# Altium schematic sheet shunts.SchDoc: Current Shunts
size A3; DocumentNumber: 1; SheetNumber: 3; SheetTotal: 5
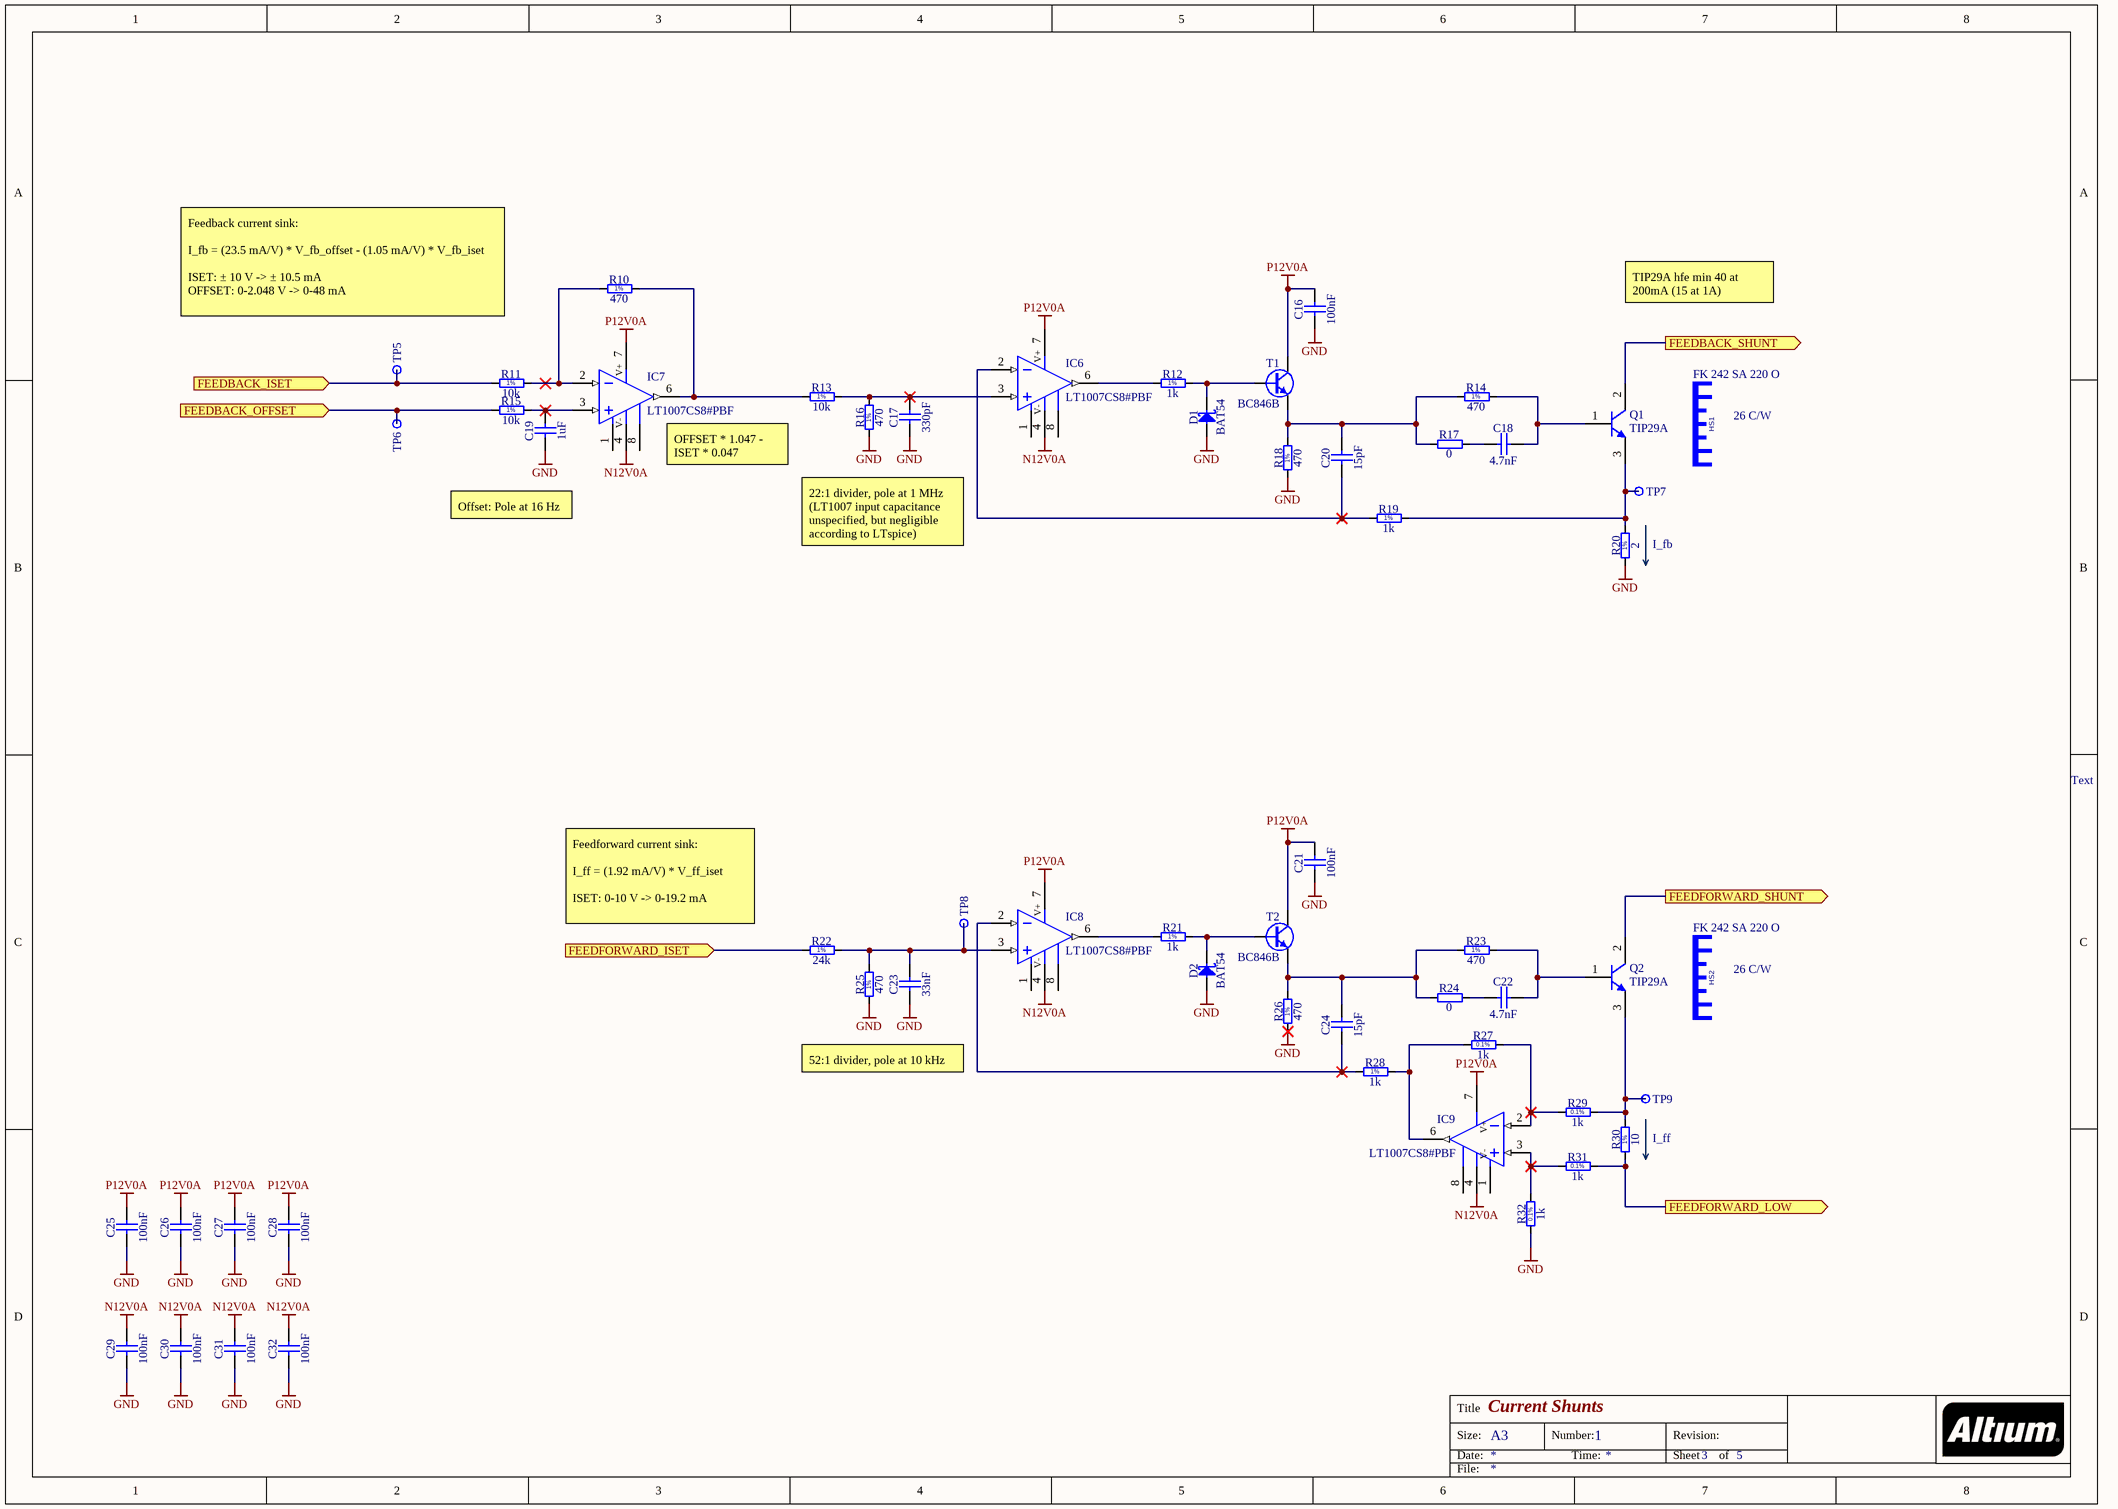
[diagram p0: shunts.SchDoc]

## Parts
C16  100nF  [CAPC1608X87N]
C17  330pF  [CAPC1608X87N]
C18  4.7nF  [CAPC1608X87N]
C19  1uF  [CAPC1608X87N]
C20  15pF  [CAPC1608X87N]
C21  100nF  [CAPC1608X87N]
C22  4.7nF  [CAPC1608X87N]
C23  33nF  [CAPC1608X87N]
C24  15pF  [CAPC1608X87N]
C25  100nF  [CAPC1608X87N]
C26  100nF  [CAPC1608X87N]
C27  100nF  [CAPC1608X87N]
C28  100nF  [CAPC1608X87N]
C29  100nF  [CAPC1608X87N]
C30  100nF  [CAPC1608X87N]
C31  100nF  [CAPC1608X87N]
C32  100nF  [CAPC1608X87N]
D1  BAT54  [SOT95P240X130-3N]
D2  BAT54  [SOT95P240X130-3N]
HS1  Manufacturer Part Number: FK 242 SA 220 O  [HSINK_FISCHER_FK 242 SA 220 O_h]  (hidden comment: Heat Sink No Pad)
HS2  Manufacturer Part Number: FK 242 SA 220 O  [HSINK_FISCHER_FK 242 SA 220 O_h]  (hidden comment: Heat Sink No Pad)
IC6  LT1007CS8#PBF  [SOIC127P600X175-8N]
IC7  LT1007CS8#PBF  [SOIC127P600X175-8N]
IC8  LT1007CS8#PBF  [SOIC127P600X175-8N]
IC9  LT1007CS8#PBF  [SOIC127P600X175-8N]
Q1  TIP29A  [ONSC-TO-220-3-221A-09]
Q2  TIP29A  [ONSC-TO-220-3-221A-09]
R10  470  [RESC1608X55N]
R11  10k  [RESC1608X55N]
R12  1k  [RESC1608X55N]
R13  10k  [RESC1608X55N]
R14  470  [RESC1608X55N]
R15  10k  [RESC1608X55N]
R16  470  [RESC1608X55N]
R17  0  [RESC1608X55N]
R18  470  [RESC1608X55N]
R19  1k  [RESC1608X55N]
R20  2  [RESC1608X55N]
R21  1k  [RESC1608X55N]
R22  24k  [RESC1608X55N]
R23  470  [RESC1608X55N]
R24  0  [RESC1608X55N]
R25  470  [RESC1608X55N]
R26  470  [RESC1608X55N]
R27  1k  [RESC1608X55N]
R28  1k  [RESC1608X55N]
R29  1k  [RESC1608X55N]
R30  10  [RESC1608X55N]
R31  1k  [RESC1608X55N]
R32  1k  [RESC1608X55N]
T1  BC846B  [SOT95P230X110-3N]
T2  BC846B  [SOT95P230X110-3N]
TP5  Test Point  [TPS127]  (value not drawn)
TP6  Test Point  [TPS127]  (value not drawn)
TP7  Test Point  [TPS127]  (value not drawn)
TP8  Test Point  [TPS127]  (value not drawn)
TP9  Test Point  [TPS127]  (value not drawn)

## Ports
FEEDBACK_ISET (in), FEEDBACK_OFFSET (in), FEEDBACK_SHUNT (out), FEEDFORWARD_ISET (in), FEEDFORWARD_LOW (out), FEEDFORWARD_SHUNT (out)

## Nets
GND: C16.1 C17.1 C19.1 C21.1 C23.1 C25.1 C26.1 C27.1 C28.1 C29.1 C30.1 C31.1 C32.1 D1.1(A) D2.1(A) R16.1 R18.1 R20.1 R25.1 R26.1 R32.1
N12V0A: C29.2 C30.2 C31.2 C32.2 IC6.4(V-) IC7.4(V-) IC8.4(V-) IC9.4(V-)
P12V0A: C16.2 C21.2 C25.2 C26.2 C27.2 C28.2 IC6.7(V+) IC7.7(V+) IC8.7(V+) IC9.7(V+) T1.3(C) T2.3(C)
FEEDBACK_ISET: R11.1 TP5.1 ; port FEEDBACK_ISET
FEEDBACK_OFFSET: R15.1 TP6.1 ; port FEEDBACK_OFFSET
FEEDBACK_SHUNT: Q1.2(C) ; port FEEDBACK_SHUNT
FEEDFORWARD_ISET: R22.1 ; port FEEDFORWARD_ISET
FEEDFORWARD_LOW: R30.1 R31.2 ; port FEEDFORWARD_LOW
FEEDFORWARD_SHUNT: Q2.2(C) ; port FEEDFORWARD_SHUNT
NetC17_2: C17.2 IC6.3(IN+) R13.2 R16.2
NetC18_1: C18.1 R17.2
NetC18_2: C18.2 Q1.1(B) R14.2
NetC19_2: C19.2 IC7.3(IN+) R15.2
NetC20_1: C20.1 IC6.2(IN-) R19.1
NetC20_2: C20.2 R14.1 R17.1 R18.2 T1.2(E)
NetC22_1: C22.1 R24.2
NetC22_2: C22.2 Q2.1(B) R23.2
NetC23_2: C23.2 IC8.3(IN+) R22.2 R25.2 TP8.1
NetC24_1: C24.1 IC8.2(IN-) R28.1
NetC24_2: C24.2 R23.1 R24.1 R26.2 T2.2(E)
NetD1_3: D1.3(C) R12.2 T1.1(B)
NetD2_3: D2.3(C) R21.2 T2.1(B)
NetIC6_6: IC6.6(OUT) R12.1
NetIC7_2: IC7.2(IN-) R10.1 R11.2
NetIC7_6: IC7.6(OUT) R10.2 R13.1
NetIC8_6: IC8.6(OUT) R21.1
NetIC9_2: IC9.2(IN-) R27.2 R29.1
NetIC9_3: IC9.3(IN+) R31.1 R32.2
NetIC9_6: IC9.6(OUT) R27.1 R28.2
NetQ1_3: Q1.3(E) R19.2 R20.2 TP7.1
NetQ2_3: Q2.3(E) R29.2 R30.2 TP9.1

Not connected (* = marked no-connect by the designer): IC6 1(OFFSET) 8(OFFSET); IC7 1(OFFSET) 8(OFFSET); IC8 1(OFFSET) 8(OFFSET); IC9 1(OFFSET) 8(OFFSET)

## Notes on the sheet
- Feedback current sink:
  I_fb = (23.5 mA/V) * V_fb_offset - (1.05 mA/V) * V_fb_iset
  ISET: ± 10 V -> ± 10.5 mA
  OFFSET: 0-2.048 V -> 0-48 mA
- TIP29A hfe min 40 at 200mA (15 at 1A)
- (near HS1) 26 C/W
- Offset: Pole at 16 Hz
- (near IC7) OFFSET * 1.047 - ISET * 0.047
- 22:1 divider, pole at 1 MHz (LT1007 input capacitance unspecified, but negligible according to LTspice)
- (near R20) I_fb
- Text
- Feedforward current sink:
  I_ff = (1.92 mA/V) * V_ff_iset
  ISET: 0-10 V -> 0-19.2 mA
- (near HS2) 26 C/W
- 52:1 divider, pole at 10 kHz
- I_ff
- Title
- Size:
- Date:
- A3
- Number:
- Time:
- Revision:
- Sheet
- of
- File:
- (in symbol R0603_1K_0.1%_0.063W_10PPM) 0.1%
- (in symbol R0603_1K_1%_0.1W_100PPM) 1%
- (in symbol R0603_2R_1%_0.1W_200PPM) 1%
- (in symbol R0603_10K_1%_0.1W_100PPM) 1%
- (in symbol R0603_10R_1%_0.1W_200PPM) 1%
- (in symbol R0603_24K_1%_0.1W_100PPM) 1%
- (in symbol R0603_470R_1%_0.1W_100PPM) 1%

## Library data of the parts
C16 C21 C25-C32 = CC0603_100NF_50V_10%_X5R: Non-polarised capacitor; Part Description: SMD Multilayer Chip Ceramic Capacitor; Manufacturer: GENERIC; Manufacturer1 Part Number: C1608X5R1H104K080AA; Voltage: 50V; TC: X5R; Tolerance: ±10%; Part Number: CC0603_100NF_50V_10%_X5R; Component Kind: Standard; Component Type: Standard; Pin Count: 2; Value: 100nF; Status: None; Manufacturer Part Number: CC0603_100NF_50V_10%_X5R; Case: 0603; Mounted: Yes; Socket: No; SMD: Yes; Sense: No; Manufacturer1 Example: TDK; Manufacturer1 ComponentHeight: 0.9mm; HelpURL: \\cern.ch\dfs\Applications\Altium\Datasheets\CC0603_X5R_TDK_C.pdf; Author: CERN DEM MR; CreateDate: 08/01/2016; LatestRevisionDate: 08/01/2016
C17 = CC0603_330PF_50V_5%_NP0: Non-polarised capacitor; Part Description: SMD Multilayer Chip Ceramic Capacitor; Manufacturer: GENERIC; Manufacturer1 Part Number: 223886715331; Voltage: 50V; TC: C0G/NP0; Tolerance: ±5%; Part Number: CC0603_330PF_50V_5%_NP0; Component Kind: Standard; Component Type: Standard; Pin Count: 2; Value: 330pF; Status: Preferred; Manufacturer Part Number: CC0603_330PF_50V_5%_NP0; Case: 0603; Mounted: Yes; Socket: No; SMD: Yes; Sense: No; Manufacturer1 Example: PHYCOMP; Manufacturer1 ComponentHeight: 0.87mm; HelpURL: \\cern.ch\dfs\Applications\Altium\Datasheets\CC0603_NP0_PHYCOMP.pdf; Author: CERN DEM JLC; CreateDate: 03/12/2007; LatestRevisionDate: 03/12/2007
C18 C22 = CC0603_4.7NF_50V_10%_X7R: Non-polarised capacitor; Part Description: SMD Multilayer Chip Ceramic Capacitor; Manufacturer: GENERIC; Manufacturer1 Part Number: 223858615632; Voltage: 50V; TC: X7R; Tolerance: ±10%; Part Number: CC0603_4.7NF_50V_10%_X7R; Component Kind: Standard; Component Type: Standard; Pin Count: 2; Value: 4.7nF; Status: Preferred; Manufacturer Part Number: CC0603_4.7NF_50V_10%_X7R; Case: 0603; Mounted: Yes; Socket: No; SMD: Yes; Sense: No; Manufacturer1 Example: PHYCOMP; Manufacturer1 ComponentHeight: 0.87mm; HelpURL: \\cern.ch\dfs\Applications\Altium\Datasheets\CC0603_X7R_PHYCOMP.pdf; Author: CERN DEM JLC; CreateDate: 03/12/2007; LatestRevisionDate: 03/12/2007
C19 = CC0603_1UF_25V_10%_X7R: Non-polarised capacitor; Part Description: SMD Multilayer Chip Ceramic Capacitor; Manufacturer: GENERIC; Manufacturer1 Part Number: GRM188R71E105KA12D; Voltage: 25V; TC: X7R; Tolerance: ±10%; Part Number: CC0603_1UF_25V_10%_X7R; Component Kind: Standard; Component Type: Standard; Pin Count: 2; Value: 1uF; Status: None; Manufacturer Part Number: CC0603_1UF_25V_10%_X7R; Case: 0603; Mounted: Yes; Socket: No; SMD: Yes; Sense: No; Manufacturer1 Example: MURATA; Manufacturer1 ComponentHeight: 0.9mm; HelpURL: \\cern.ch\dfs\Applications\Altium\Datasheets\CC0603_X7R_MURATA.pdf; Author: CERN DEM JLC; CreateDate: 18/01/2011; LatestRevisionDate: 18/01/2011
C20 C24 = CC0603_15PF_50V_5%_NP0: Non-polarised capacitor; Part Description: SMD Multilayer Chip Ceramic Capacitor; Manufacturer: GENERIC; Manufacturer1 Part Number: 223886715159; Voltage: 50V; TC: C0G/NP0; Tolerance: ±5%; Part Number: CC0603_15PF_50V_5%_NP0; Component Kind: Standard; Component Type: Standard; Pin Count: 2; Value: 15pF; Status: Preferred; Manufacturer Part Number: CC0603_15PF_50V_5%_NP0; Case: 0603; Mounted: Yes; Socket: No; SMD: Yes; Sense: No; Manufacturer1 Example: PHYCOMP; Manufacturer1 ComponentHeight: 0.87mm; HelpURL: \\cern.ch\dfs\Applications\Altium\Datasheets\CC0603_NP0_PHYCOMP.pdf; Author: CERN DEM JLC; CreateDate: 03/12/2007; LatestRevisionDate: 03/12/2007
C23 = CC0603_33NF_25V_10%_X7R: Non-polarised capacitor; Part Description: SMD Multilayer Chip Ceramic Capacitor; Manufacturer: GENERIC; Manufacturer1 Part Number: 223891615643; Voltage: 25V; TC: X7R; Tolerance: ±10%; Part Number: CC0603_33NF_25V_10%_X7R; Component Kind: Standard; Component Type: Standard; Pin Count: 2; Value: 33nF; Status: Preferred; Manufacturer Part Number: CC0603_33NF_25V_10%_X7R; Case: 0603; Mounted: Yes; Socket: No; SMD: Yes; Sense: No; Manufacturer1 Example: PHYCOMP; Manufacturer1 ComponentHeight: 0.87mm; HelpURL: \\cern.ch\dfs\Applications\Altium\Datasheets\CC0603_X7R_PHYCOMP.pdf; Author: CERN DEM JLC; CreateDate: 03/12/2007; LatestRevisionDate: 03/12/2007
D1 D2 = BAT54: Diode Schottky  Anode Pin 1 Cathode Pin 3 (Pas de pin 2); Part Description: Single Small Signal Schottky Diode; Manufacturer: FAIRCHILD SEMICONDUCTOR; Voltage: 30V; Power: 200mA; PressFit: No; Bonding: No; Part Number: BAT54; Component Kind: Standard; Component Type: Standard; Device: BAT54; PackageDescription: SOT23 3-Leads, Pitch 0.95mm - Body 1.3x2.9mm, IPC Medium Density; Manufacturer Part Number: BAT54; Pin Count: 3; Case: SOT23-3; Mounted: Yes; Socket: No; SMD: Yes; Sense: No; ComponentHeight: 1.30mm; HelpURL: \\cern.ch\dfs\Applications\Altium\Datasheets\BAT54.pdf; Author: CERN DEM JLC; CreateDate: 17/09/2009; LatestRevisionDate: 27/05/2010
  D1: Digi-Key: *
HS1 HS2 = HSINK_FISCHER_FK 242 SA 220 O_h: Heat Sink Without Pad; Part Description: TO-220 Heat Sink  Rth: 26°C/W - Horizontal Mount; Manufacturer: FISCHER ELEKTRONIK; PressFit: No; Part Number: HSINK_FISCHER_FK 242 SA 220 O_h; Component Kind: Standard; Component Type: Standard; Pin Count: 0; PackageDescription: TO-220 Heat Sink  Rth: 26°C/W - Horizontal Mount; Mounted: Yes; Socket: No; SMD: No; Sense: No; Status: None; ComponentHeight: 12.7mm; HelpURL: \\cern.ch\dfs\Applications\Altium\Datasheets\HSINK_FISCHER_FK 242 SA 220 O.pdf; Author: CERN DEM JLC; CreateDate: 29/03/2011; LatestRevisionDate: 10/10/2011
IC6-IC9 = LT1007CS8#PBF: Operational Amplifier with Offset 1-8; Part Description: Low Noise, High Speed Precision Operational Amplifier; Manufacturer: LINEAR TECHNOLOGY; PressFit: No; Bonding: No; Part Number: LT1007CS8#PBF; Component Kind: Standard; Component Type: Standard; Device: LT1007CS8#PBF; PackageDescription: SOIC 8, Pitch 1.27mm - Body 4x5mm, IPC Medium Density; Manufacturer Part Number: LT1007CS8#PBF; Pin Count: 7; Case: SOIC8; Mounted: Yes; Socket: No; SMD: Yes; Sense: No; ComponentHeight: 1.75mm; Author: CERN DEM JLC; HelpURL: \\cern.ch\dfs\Applications\Altium\Datasheets\LT1007CS8#PBF.pdf; CreateDate: 09/03/2011; LatestRevisionDate: 09/03/2011
Q1 Q2 = TIP29A: Complementary Silicon Plastic Power Transistor, 3-Pin TO-220, Tube; Manufacturer: On Semiconductor; Note: 0; fT Min (MHz): 3; IC Continuous (A): 1; Polarity: NPN; DatasheetVersion: Rev. 12; PackageVersion: Rev. AG, 09/2011; PackageReference: TO-220-3-221A-09; PackageDescription: 3-Pin Flange Mount, Vertical Straight Lead, Body 9.97 x 4.445 mm, Pitch 2.54 mm; Packing: Tube; RoHS: FALSE; Mounting Technology: Through Hole; PartNumber: TIP29A; ComponentLink1Description: Manufacturer URL; ComponentLink1URL: http://www.onsemi.com/; ComponentLink2Description: Datasheet; ComponentLink2URL: http://www.onsemi.com/pub_link/Collateral/TIP29B-D.PDF; ComponentLink3Description: Package Specification; ComponentLink3URL: http://www.onsemi.com/pub_link/Collateral/221A-09.PDF; Manufacturer Part Number: TIP29A; Device: TIP29A
R10 R14 R16 R18 R23 R25 R26 = R0603_470R_1%_0.1W_100PPM: Resistor - 1%; Part Description: General Purpose Thick Film Chip Resistor; Manufacturer: GENERIC; Manufacturer1 Part Number: NRC06F4700TRF; Power: 0.1W; TC: ±100ppm/°C; PressFit: No; Part Number: R0603_470R_1%_0.1W_100PPM; Component Kind: Standard; Component Type: Standard; Pin Count: 2; Value: 470; Status: Preferred; Tolerance: ±1%; Manufacturer Part Number: R0603_470R_1%_0.1W_100PPM; Case: 0603; Mounted: Yes; Sense: No; Socket: No; SMD: Yes; Manufacturer1 Example: NIC COMPONENT; Manufacturer1 ComponentHeight: 0.55mm; HelpURL: \\cern.ch\dfs\Applications\Altium\Datasheets\R0603_NIC_NRC.pdf; Author: CERN DEM JLC; CreateDate: 03/12/2007; LatestRevisionDate: 13/03/2008
R11 R13 R15 = R0603_10K_1%_0.1W_100PPM: Resistor - 1%; Part Description: General Purpose Thick Film Chip Resistor; Manufacturer: GENERIC; Manufacturer1 Part Number: NRC06F1002TRF; Power: 0.1W; TC: ±100ppm/°C; PressFit: No; Part Number: R0603_10K_1%_0.1W_100PPM; Component Kind: Standard; Component Type: Standard; Pin Count: 2; Value: 10k; Status: Preferred; Tolerance: ±1%; Manufacturer Part Number: R0603_10K_1%_0.1W_100PPM; Case: 0603; Mounted: Yes; Sense: No; Socket: No; SMD: Yes; Manufacturer1 Example: NIC COMPONENT; Manufacturer1 ComponentHeight: 0.55mm; HelpURL: \\cern.ch\dfs\Applications\Altium\Datasheets\R0603_NIC_NRC.pdf; Author: CERN DEM JLC; CreateDate: 03/12/2007; LatestRevisionDate: 13/03/2008
R12 R19 R21 R28 = R0603_1K_1%_0.1W_100PPM: Resistor - 1%; Part Description: General Purpose Thick Film Chip Resistor; Manufacturer: GENERIC; Manufacturer1 Part Number: NRC06F1001TRF; Power: 0.1W; TC: ±100ppm/°C; PressFit: No; Part Number: R0603_1K_1%_0.1W_100PPM; Component Kind: Standard; Component Type: Standard; Pin Count: 2; Value: 1k; Status: Preferred; Tolerance: ±1%; Manufacturer Part Number: R0603_1K_1%_0.1W_100PPM; Case: 0603; Mounted: Yes; Sense: No; Socket: No; SMD: Yes; Manufacturer1 Example: NIC COMPONENT; Manufacturer1 ComponentHeight: 0.55mm; HelpURL: \\cern.ch\dfs\Applications\Altium\Datasheets\R0603_NIC_NRC.pdf; Author: CERN DEM JLC; CreateDate: 03/12/2007; LatestRevisionDate: 13/03/2008
R17 R24 = R0603_0R_JUMPER: Resistor; Part Description: 1A (0.05R Max DC Resistance) Zero Ohm Jumper; Manufacturer: GENERIC; Manufacturer1 Part Number: NRC06Z0; PressFit: No; Part Number: R0603_0R_JUMPER; Component Kind: Standard; Component Type: Standard; Pin Count: 2; Value: 0; Status: Preferred; Manufacturer Part Number: R0603_0R_JUMPER; Case: 0603; Mounted: Yes; Sense: No; Socket: No; SMD: Yes; Manufacturer1 Example: NIC COMPONENT; Manufacturer1 ComponentHeight: 0.55mm; HelpURL: \\cern.ch\dfs\Applications\Altium\Datasheets\R0603_NIC_NRC.pdf; Author: CERN DEM JLC; CreateDate: 03/12/2007; LatestRevisionDate: 13/03/2008
R20 = R0603_2R_1%_0.1W_200PPM: Resistor - 1%; Part Description: General Purpose Thick Film Chip Resistor; Manufacturer: GENERIC; Manufacturer1 Part Number: 232270462008L or RC0603FR-072RL; Power: 0.1W; TC: ±200ppm/°C; PressFit: No; Part Number: R0603_2R_1%_0.1W_200PPM; Component Kind: Standard; Component Type: Standard; Pin Count: 2; Value: 2; Status: Preferred; Tolerance: ±1%; Manufacturer Part Number: R0603_2R_1%_0.1W_200PPM; Case: 0603; Mounted: Yes; Sense: No; Socket: No; SMD: Yes; Manufacturer1 Example: YAGEO PHYCOMP; Manufacturer1 ComponentHeight: 0.65mm; HelpURL: \\cern.ch\dfs\Applications\Altium\Datasheets\R0603_Tyco_RN73.pdf; Author: CERN DEM JLC; CreateDate: 03/12/2007; LatestRevisionDate: 17/10/2012
R22 = R0603_24K_1%_0.1W_100PPM: Resistor - 1%; Part Description: General Purpose Thick Film Chip Resistor; Manufacturer: GENERIC; Manufacturer1 Part Number: NRC06F2402TRF; Power: 0.1W; TC: ±100ppm/°C; PressFit: No; Part Number: R0603_24K_1%_0.1W_100PPM; Component Kind: Standard; Component Type: Standard; Pin Count: 2; Value: 24k; Status: Preferred; Tolerance: ±1%; Manufacturer Part Number: R0603_24K_1%_0.1W_100PPM; Case: 0603; Mounted: Yes; Sense: No; Socket: No; SMD: Yes; Manufacturer1 Example: NIC COMPONENT; Manufacturer1 ComponentHeight: 0.55mm; HelpURL: \\cern.ch\dfs\Applications\Altium\Datasheets\R0603_NIC_NRC.pdf; Author: CERN DEM JLC; CreateDate: 03/12/2007; LatestRevisionDate: 13/03/2008
R27 R29 R31 R32 = R0603_1K_0.1%_0.063W_10PPM: Resistor - 0.1%; Part Description: Thin Film Chip Resistor; Manufacturer: GENERIC; Manufacturer1 Part Number: RN73C1J1K0BTG; Power: 0.063W; TC: ±10ppm; PressFit: No; Part Number: R0603_1K_0.1%_0.063W_10PPM; Component Kind: Standard; Component Type: Standard; Pin Count: 2; Value: 1k; Status: Not Recommended; Tolerance: ±0.1%; Manufacturer Part Number: R0603_1K_0.1%_0.063W_10PPM; Case: 0603; Mounted: Yes; Sense: No; Socket: No; SMD: Yes; Manufacturer1 Example: TYCO HOLSWORTHY; Manufacturer1 ComponentHeight: 0.55mm; HelpURL: \\cern.ch\dfs\Applications\Altium\Datasheets\R0603_Tyco_RN73.pdf; Author: CERN DEM BC; CreateDate: 23/05/2016; LatestRevisionDate: 23/05/2016
R30 = R0603_10R_1%_0.1W_200PPM: Resistor - 1%; Part Description: General Purpose Thick Film Chip Resistor; Manufacturer: GENERIC; Manufacturer1 Part Number: NRC06F10R0TRF; Power: 0.1W; TC: ±200ppm/°C; PressFit: No; Part Number: R0603_10R_1%_0.1W_200PPM; Component Kind: Standard; Component Type: Standard; Pin Count: 2; Value: 10; Status: Preferred; Tolerance: ±1%; Manufacturer Part Number: R0603_10R_1%_0.1W_200PPM; Case: 0603; Mounted: Yes; Sense: No; Socket: No; SMD: Yes; Manufacturer1 Example: NIC COMPONENT; Manufacturer1 ComponentHeight: 0.55mm; HelpURL: \\cern.ch\dfs\Applications\Altium\Datasheets\R0603_NIC_NRC.pdf; Author: CERN DEM JLC; CreateDate: 03/12/2007; LatestRevisionDate: 24/06/2009
T1 T2 = BC846B: NPN Transistor; Part Description: 65 V 100mA NPN general-purpose transistors; Manufacturer: NXP SEMICONDUCTORS; PressFit: No; Bonding: No; Part Number: BC846B; Component Kind: Standard; Component Type: Standard; Device: BC846B; PackageDescription: SOT23, 3 pin, Pitch 0.95mm - 1.3mm W X 2.9mm L X 1.1mm H, IPC Medium Density; Manufacturer Part Number: BC846B; Pin Count: 3; Case: SOT23-3; Mounted: Yes; Socket: No; SMD: Yes; Sense: No; ComponentHeight: 1.1mm; HelpURL: \\cern.ch\dfs\Applications\Altium\Datasheets\BC846B.pdf; Author: CERN DEM JLC; CreateDate: 10/03/2011; LatestRevisionDate: 10/03/2011
TP5-TP9 = SMD_PAD_1.27X1.27MM: Part Description: 1.27mm x 1.27mm PCB Copper Area (SMD Test Point); Mounted: No; Part Number: SMD_PAD_1.27X1.27MM; Component Kind: Standard (No BOM); Component Type: Standard (No BOM); Pin Count: 1; Family: Test Point; Socket: No; SMD: Yes; Sense: No; Status: None; ComponentHeight: 0mm; HelpURL: Undefined; Author: CERN DEM JLC; CreateDate: 12/01/2008; LatestRevisionDate: 12/01/2008; PackageDescription: 1.27mm x 1.27mm PCB Copper Area (SMD Test Point)